# Altium schematic sheet SbusServoTray.SchDoc
size A4; SheetNumber: 1; SheetTotal: 1
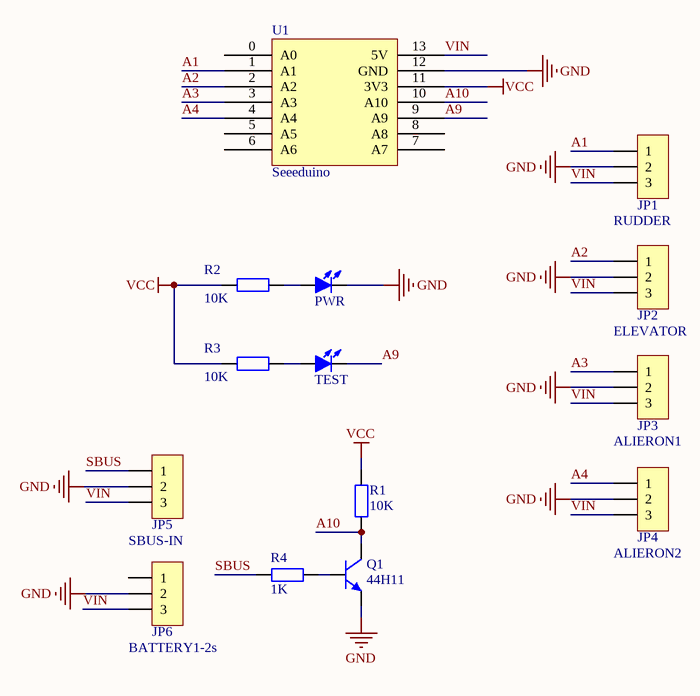
[diagram p0: SbusServoTray.SchDoc]

## Parts
JP1  RUDDER  [2.54-3P]
JP2  ELEVATOR  [2.54-3P]
JP3  ALIERON1  [2.54-3P]
JP4  ALIERON2  [2.54-3P]
JP5  SBUS-IN  [HDR2.54-WI-3P]
JP6  BATTERY1-2s  [HDR2.54-WI-3P]
PWR  红色  [LED 0805B]  (value not drawn)
Q1  44H11  [SOT23-3N]
R1  10K  [0805R]
R2  10K  [0805R]
R3  10K  [0805R]
R4  1K  [0805R]
TEST  红色  [LED 0805W]  (value not drawn)
U1  Seeeduino  [Seeeduino]

## Nets
GND: JP1.2 JP2.2 JP3.2 JP4.2 JP5.2 JP6.2 PWR.2(K) Q1.3(E) U1.12(GND)
VCC: R1.1 R2.1 R3.1 U1.11(3V3)
A1: JP1.1 U1.1(A1)
A2: JP2.1 U1.2(A2)
A3: JP3.1 U1.3(A3)
A4: JP4.1 U1.4(A4)
A9: TEST.2(K) U1.9(A9)
A10: Q1.2(C) R1.2 U1.10(A10)
SBUS: JP5.1 R4.1
VIN: JP1.3 JP2.3 JP3.3 JP4.3 JP5.3 JP6.3 U1.13(5V)
NetPWR_1: PWR.1(A) R2.2
NetQ1_1: Q1.1(B) R4.2
NetR3_2: R3.2 TEST.1(A)

Not connected (* = marked no-connect by the designer): JP6 1; U1 0(A0) 5(A5) 6(A6) 7(A7) 8(A8)

## Library data of the parts
JP1-JP6 = Header 3: 3P接插件; 版权归属: 源创客; BOM名称: 3P接插件; 学习资源: www.ooocke.com
PWR TEST = LED-SMD: 贴片LED; 版权归属: 源创客; BOM名称: 贴片LED; 学习资源: www.ooocke.com
Q1 = 44H11: 互补功率-NPN型; 版权归属: 源创客; 属性: 80V 8A 50W; BOM名称: 互补功率-NPN型; 学习资源: www.ooocke.com
R1-R4 = R: 贴片电阻; 版权归属: 源创客; BOM名称: 贴片电阻; 学习资源: www.ooocke.com